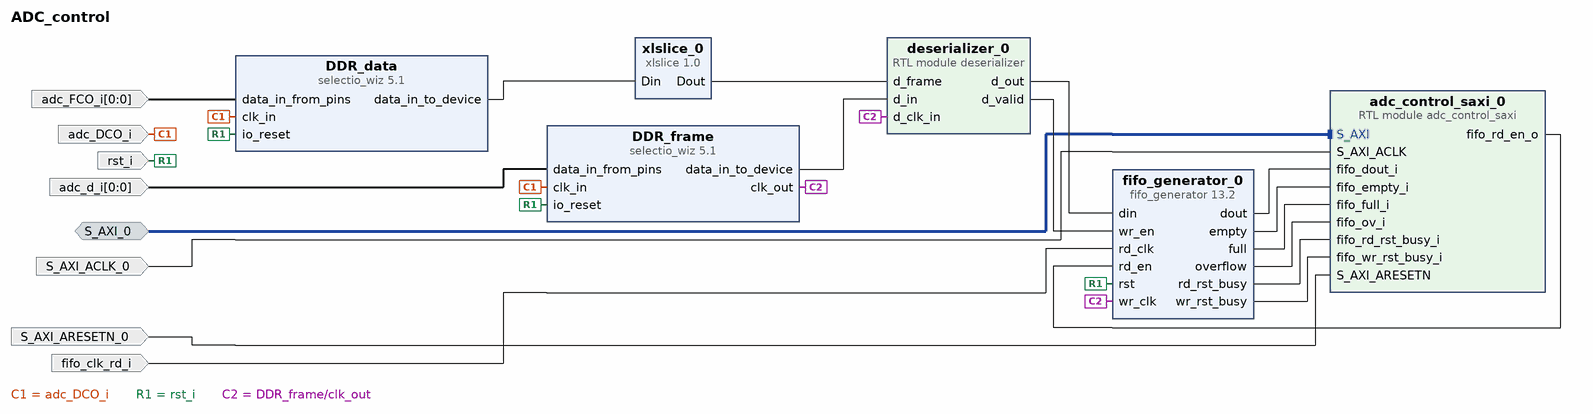
[diagram p0: block diagram of the top level]
# Vivado block design ADC_control, xc7z030fbg676-2, Vivado 2019.1
create_bd_design ADC_control

create_bd_intf_port -mode Slave -vlnv xilinx.com:interface:aximm_rtl:1.0 S_AXI_0
set_property -dict [list \
  CONFIG.ADDR_WIDTH 12 \
  CONFIG.ARUSER_WIDTH 0 \
  CONFIG.AWUSER_WIDTH 0 \
  CONFIG.BUSER_WIDTH 0 \
  CONFIG.DATA_WIDTH 32 \
  CONFIG.HAS_BRESP 1 \
  CONFIG.HAS_BURST 0 \
  CONFIG.HAS_CACHE 0 \
  CONFIG.HAS_LOCK 0 \
  CONFIG.HAS_PROT 1 \
  CONFIG.HAS_QOS 0 \
  CONFIG.HAS_REGION 0 \
  CONFIG.HAS_RRESP 1 \
  CONFIG.HAS_WSTRB 1 \
  CONFIG.ID_WIDTH 0 \
  CONFIG.MAX_BURST_LENGTH 1 \
  CONFIG.NUM_READ_OUTSTANDING 1 \
  CONFIG.NUM_READ_THREADS 1 \
  CONFIG.NUM_WRITE_OUTSTANDING 1 \
  CONFIG.NUM_WRITE_THREADS 1 \
  CONFIG.PROTOCOL AXI4LITE \
  CONFIG.READ_WRITE_MODE READ_WRITE \
  CONFIG.RUSER_BITS_PER_BYTE 0 \
  CONFIG.RUSER_WIDTH 0 \
  CONFIG.SUPPORTS_NARROW_BURST 0 \
  CONFIG.WUSER_BITS_PER_BYTE 0 \
  CONFIG.WUSER_WIDTH 0 \
] [get_bd_intf_ports S_AXI_0]
create_bd_port -dir I -type clk S_AXI_ACLK_0
create_bd_port -dir I -type rst S_AXI_ARESETN_0
create_bd_port -dir I -type clk adc_DCO_i
create_bd_port -dir I -from 0 -to 0 adc_FCO_i
create_bd_port -dir I -from 0 -to 0 adc_d_i
create_bd_port -dir I -type clk fifo_clk_rd_i
create_bd_port -dir I -type rst rst_i
set_property -dict {CONFIG.POLARITY ACTIVE_HIGH} [get_bd_ports rst_i]

create_bd_cell -type ip -vlnv xilinx.com:ip:selectio_wiz:5.1 DDR_data
set_property -dict [list \
  CONFIG.SELIO_ACTIVE_EDGE DDR \
  CONFIG.SELIO_CLK_BUF MMCM \
  CONFIG.SELIO_INTERFACE_TYPE NETWORKING \
  CONFIG.SERIALIZATION_FACTOR 4 \
] [get_bd_cells DDR_data]
create_bd_cell -type ip -vlnv xilinx.com:ip:selectio_wiz:5.1 DDR_frame
set_property -dict [list \
  CONFIG.SELIO_ACTIVE_EDGE DDR \
  CONFIG.SELIO_INTERFACE_TYPE NETWORKING \
  CONFIG.SERIALIZATION_FACTOR 4 \
] [get_bd_cells DDR_frame]
create_bd_cell -type module -reference adc_control_saxi adc_control_saxi_0
create_bd_cell -type module -reference deserializer deserializer_0
create_bd_cell -type ip -vlnv xilinx.com:ip:fifo_generator:13.2 fifo_generator_0
set_property -dict [list \
  CONFIG.Enable_Safety_Circuit true \
  CONFIG.Fifo_Implementation Independent_Clocks_Block_RAM \
  CONFIG.Full_Flags_Reset_Value 1 \
  CONFIG.Input_Data_Width 14 \
  CONFIG.Output_Data_Width 14 \
  CONFIG.Overflow_Flag true \
  CONFIG.Performance_Options First_Word_Fall_Through \
  CONFIG.Reset_Pin true \
  CONFIG.Use_Dout_Reset true \
] [get_bd_cells fifo_generator_0]
create_bd_cell -type ip -vlnv xilinx.com:ip:xlslice:1.0 xlslice_0
set_property -dict {CONFIG.DIN_FROM 0 CONFIG.DIN_TO 0 CONFIG.DIN_WIDTH 2 CONFIG.DOUT_WIDTH 1} [get_bd_cells xlslice_0]

# ---- connections ----

connect_bd_intf_net -intf_net S_AXI_0_1 [get_bd_intf_ports S_AXI_0] [get_bd_intf_pins adc_control_saxi_0/S_AXI]
connect_bd_net -net S_AXI_ACLK_0_1 [get_bd_ports S_AXI_ACLK_0] [get_bd_pins adc_control_saxi_0/S_AXI_ACLK]
connect_bd_net [get_bd_pins adc_control_saxi_0/fifo_rd_en_o] [get_bd_pins fifo_generator_0/rd_en]
connect_bd_net -net aresetn_0_1 [get_bd_ports S_AXI_ARESETN_0] [get_bd_pins adc_control_saxi_0/S_AXI_ARESETN]
connect_bd_net -net clk_in_0_1 [get_bd_ports adc_DCO_i] [get_bd_pins DDR_frame/clk_in] [get_bd_pins DDR_data/clk_in]
connect_bd_net -net data_in_from_pins_0_1 [get_bd_ports adc_d_i] [get_bd_pins DDR_frame/data_in_from_pins]
connect_bd_net -net data_in_from_pins_1_1 [get_bd_ports adc_FCO_i] [get_bd_pins DDR_data/data_in_from_pins]
connect_bd_net [get_bd_pins deserializer_0/d_out] [get_bd_pins fifo_generator_0/din]
connect_bd_net [get_bd_pins deserializer_0/d_valid] [get_bd_pins fifo_generator_0/wr_en]
connect_bd_net [get_bd_pins fifo_generator_0/dout] [get_bd_pins adc_control_saxi_0/fifo_dout_i]
connect_bd_net [get_bd_pins fifo_generator_0/empty] [get_bd_pins adc_control_saxi_0/fifo_empty_i]
connect_bd_net [get_bd_pins fifo_generator_0/full] [get_bd_pins adc_control_saxi_0/fifo_full_i]
connect_bd_net [get_bd_pins fifo_generator_0/overflow] [get_bd_pins adc_control_saxi_0/fifo_ov_i]
connect_bd_net [get_bd_pins fifo_generator_0/rd_rst_busy] [get_bd_pins adc_control_saxi_0/fifo_rd_rst_busy_i]
connect_bd_net [get_bd_pins fifo_generator_0/wr_rst_busy] [get_bd_pins adc_control_saxi_0/fifo_wr_rst_busy_i]
connect_bd_net -net io_reset_0_1 [get_bd_ports rst_i] \
  [get_bd_pins DDR_data/io_reset] [get_bd_pins DDR_frame/io_reset] [get_bd_pins fifo_generator_0/rst]
connect_bd_net -net rd_clk_0_1 [get_bd_ports fifo_clk_rd_i] [get_bd_pins fifo_generator_0/rd_clk]
connect_bd_net -net selectio_wiz_0_clk_out [get_bd_pins DDR_frame/clk_out] [get_bd_pins deserializer_0/d_clk_in] [get_bd_pins fifo_generator_0/wr_clk]
connect_bd_net -net selectio_wiz_0_data_in_to_device [get_bd_pins DDR_frame/data_in_to_device] [get_bd_pins deserializer_0/d_in]
connect_bd_net -net selectio_wiz_1_data_in_to_device [get_bd_pins DDR_data/data_in_to_device] [get_bd_pins xlslice_0/Din]
connect_bd_net [get_bd_pins xlslice_0/Dout] [get_bd_pins deserializer_0/d_frame]

# ---- address map ----
assign_bd_address -offset 0x000 -range 4K -target_address_space [get_bd_addr_spaces S_AXI_0] [get_bd_addr_segs adc_control_saxi_0/S_AXI/reg0]

validate_bd_design
save_bd_design
